# EAGLE design owl (EAGLE 7.5.0)
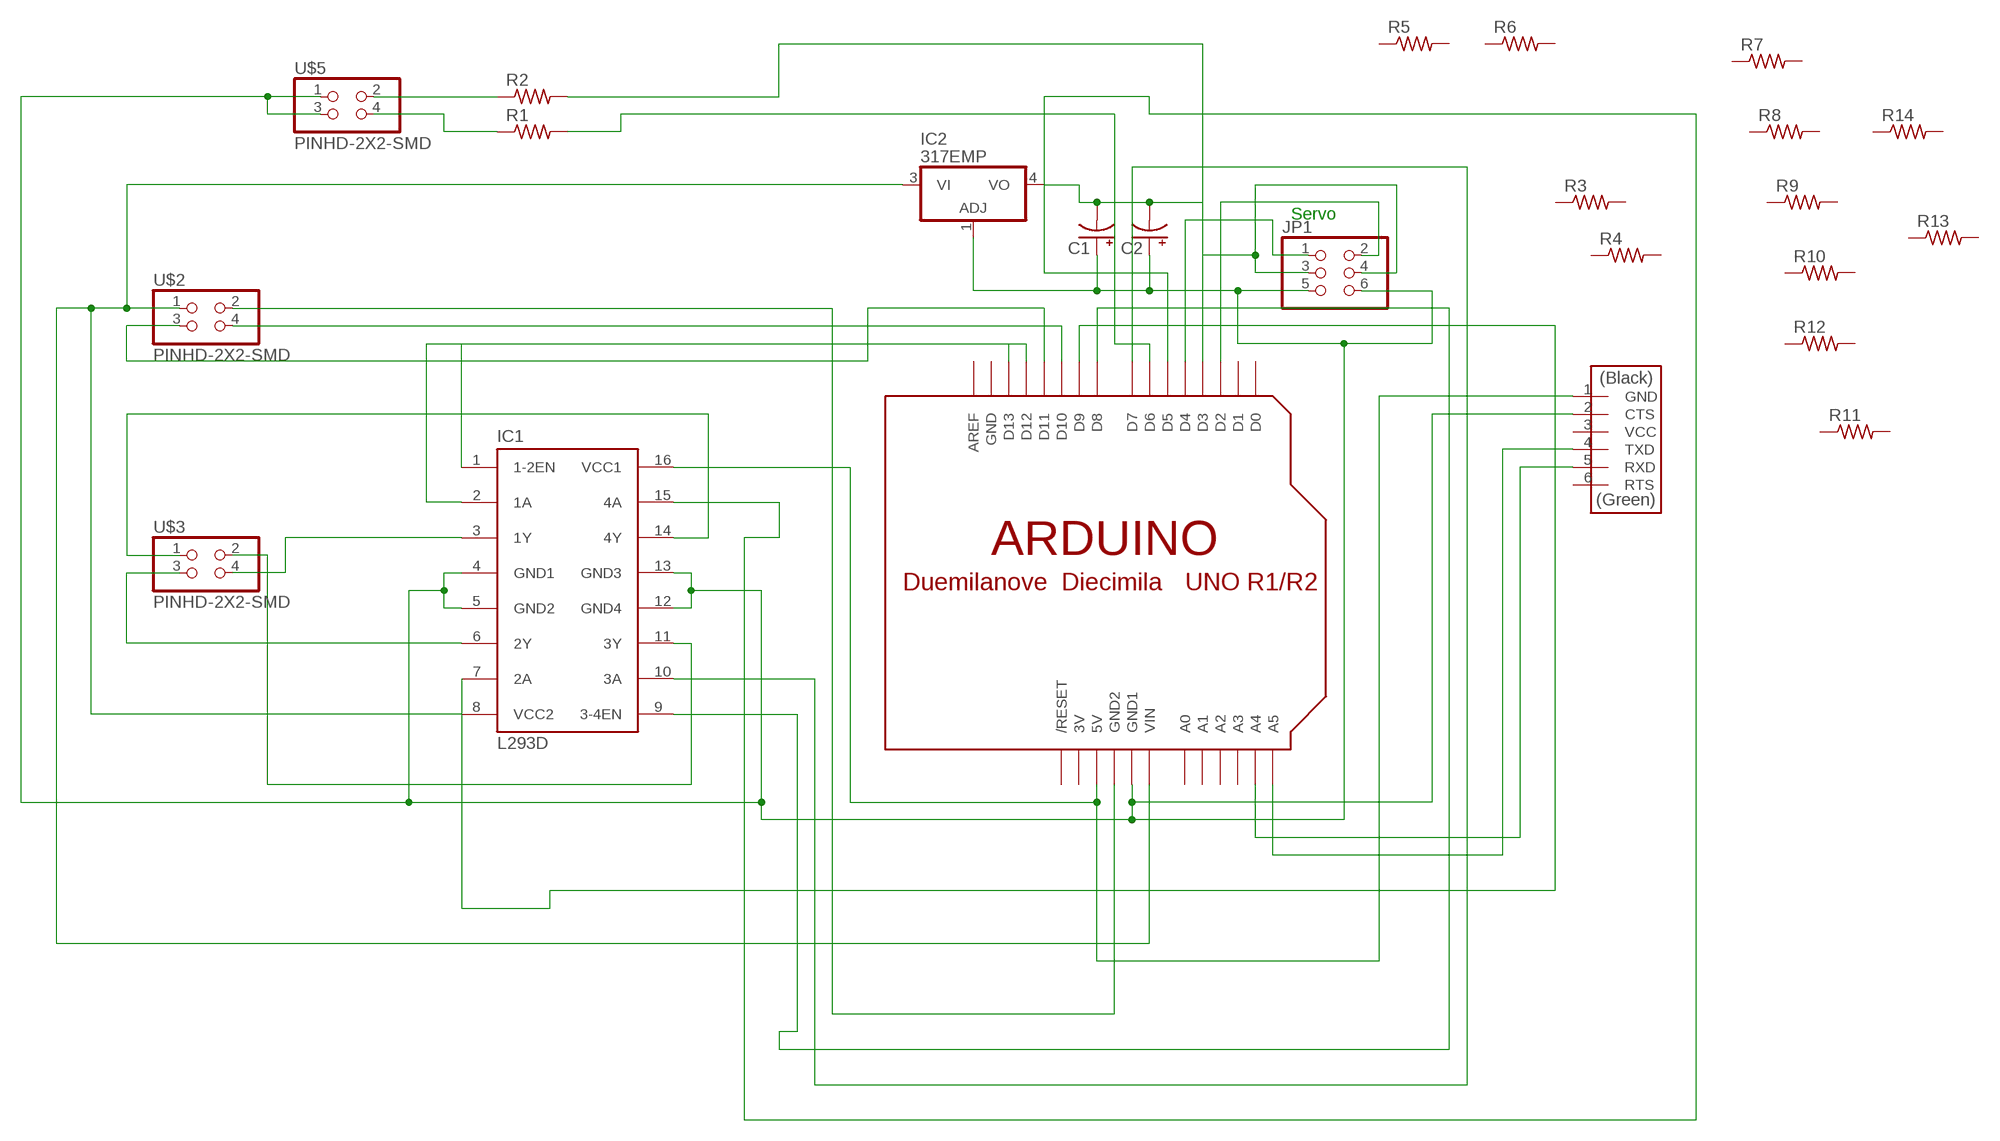
[diagram p0: schematic, sheet 1]

## Parts
C1  CPOL-US085CS-1AR  [085CS_1AR]
C2  CPOL-US085CS-1AR  [085CS_1AR]
IC1  L293D  [DIL16]
IC2  317EMP  [SOT223]
JP1  PINHD-2X3-SMD  [2X03SMD]
R1  RES-US1206FAB  [R1206FAB]
R2  RES-US1206FAB  [R1206FAB]
R3  RES-US1206FAB  [R1206FAB]
R4  RES-US1206FAB  [R1206FAB]
R5  RES-US1206FAB  [R1206FAB]
R6  RES-US1206FAB  [R1206FAB]
R7  RES-US1206FAB  [R1206FAB]
R8  RES-US1206FAB  [R1206FAB]
R9  RES-US1206FAB  [R1206FAB]
R10  RES-US1206FAB  [R1206FAB]
R11  RES-US1206FAB  [R1206FAB]
R12  RES-US1206FAB  [R1206FAB]
R13  RES-US1206FAB  [R1206FAB]
R14  RES-US1206FAB  [R1206FAB]
U$1  ARDUINO-NOHOLE  [ARDUINO-NOHOLE]
U$2  PINHD-2X2-SMD  [2X02SMD]
U$3  PINHD-2X2-SMD  [2X02SMD]
U$4  FTDI-SMD-HEADER  [1X06SMD]
U$5  PINHD-2X2-SMD  [2X02SMD]

## Nets
N$1: IC1.6(2Y) U$3.3
N$2: IC1.3(1Y) U$3.4
N$4: R2.2 U$1.D3
N$6: IC1.1(1-2EN) U$1.D13
N$7: R2.1 U$5.2
N$8: C1.- C2.- IC2.4(VO) JP1.3 JP1.4
N$9: U$1.GND2 U$2.2
N$10: IC1.2(1A) U$1.D12
N$11: U$1.D10 U$2.4
N$12: U$1.D11 U$2.3
N$13: IC1.16(VCC1) U$1.5V U$4.1(GND)
N$14: IC1.7(2A) U$1.D9
N$15: IC1.9(3-4EN) U$1.D8
N$16: IC1.10(3A) U$1.D7
N$17: IC1.15(4A) U$1.D5
N$18: U$1.A5 U$4.4(TXD)
N$19: U$1.A4 U$4.5(RXD)
N$20: JP1.2 U$1.D2
N$21: R1.1 U$5.4
N$23: R1.2 U$1.D6
N$24: JP1.1 U$1.D4
N$26: IC1.14(4Y) U$3.1
N$27: IC1.11(3Y) U$3.2
N$28: C1.+ C2.+ IC1.4(GND1) IC1.5(GND2) IC1.12(GND4) IC1.13(GND3) IC2.1(ADJ) JP1.5 JP1.6 U$1.GND1 U$4.2(CTS) U$5.1 U$5.3
N$30: IC1.8(VCC2) IC2.3(VI) U$1.VIN U$2.1
Unconnected: R3.1 R3.2 R4.1 R4.2 R5.1 R5.2 R6.1 R6.2 R7.1 R7.2 R8.1 R8.2 R9.1 R9.2 R10.1 R10.2 R11.1 R11.2 R12.1 R12.2 R13.1 R13.2 R14.1 R14.2 U$1.A0 U$1.A1 U$1.A2 U$1.A3 U$1.AREF U$1.D0 U$1.D1 U$1.RESET(/RESET) U$4.3(VCC) U$4.6(RTS)

## Notes on the sheet
- Servo

## Power pins joined to a net without a drawn wire
3V: U$1.3V
GND: U$1.GND

## Library data of the parts
C1 C2 = kesäseteli kirjasto:CPOL-US: POLARIZED CAPACITOR, American symbol
IC1 = kesäseteli kirjasto:L293D: PUSH-PULL 4 CHANNEL DRIVER; MPN: L293D; OC_FARNELL: 9589619; OC_NEWARK: 56P8249
IC2 = kesäseteli kirjasto:*317: Positive VOLTAGE REGULATOR
JP1 = kesäseteli kirjasto:PINHD-2X3-SMD: PIN HEADER
R1-R14 = kesäseteli kirjasto:RES-US: Resistor (US Symbol) Variants with postfix FAB are widened to allow the routing of internal traces
U$1 = kesäseteli kirjasto:ARDUINO: Arduino Diecimila/Duemilanove Make a shield with ease, this package has all the named pins as well as the two mounting drill holes and an outline of the USB and DC power connector. The outline is on the DIMENSION layer, so if your board house uses it they will cut the outline to match. http://www.ladyada.net/library/pcb/eaglelibrary.html
U$2 U$3 U$5 = kesäseteli kirjasto:PINHD-2X2-SMD
U$4 = kesäseteli kirjasto:FTDI-SMD-HEADER

## Board
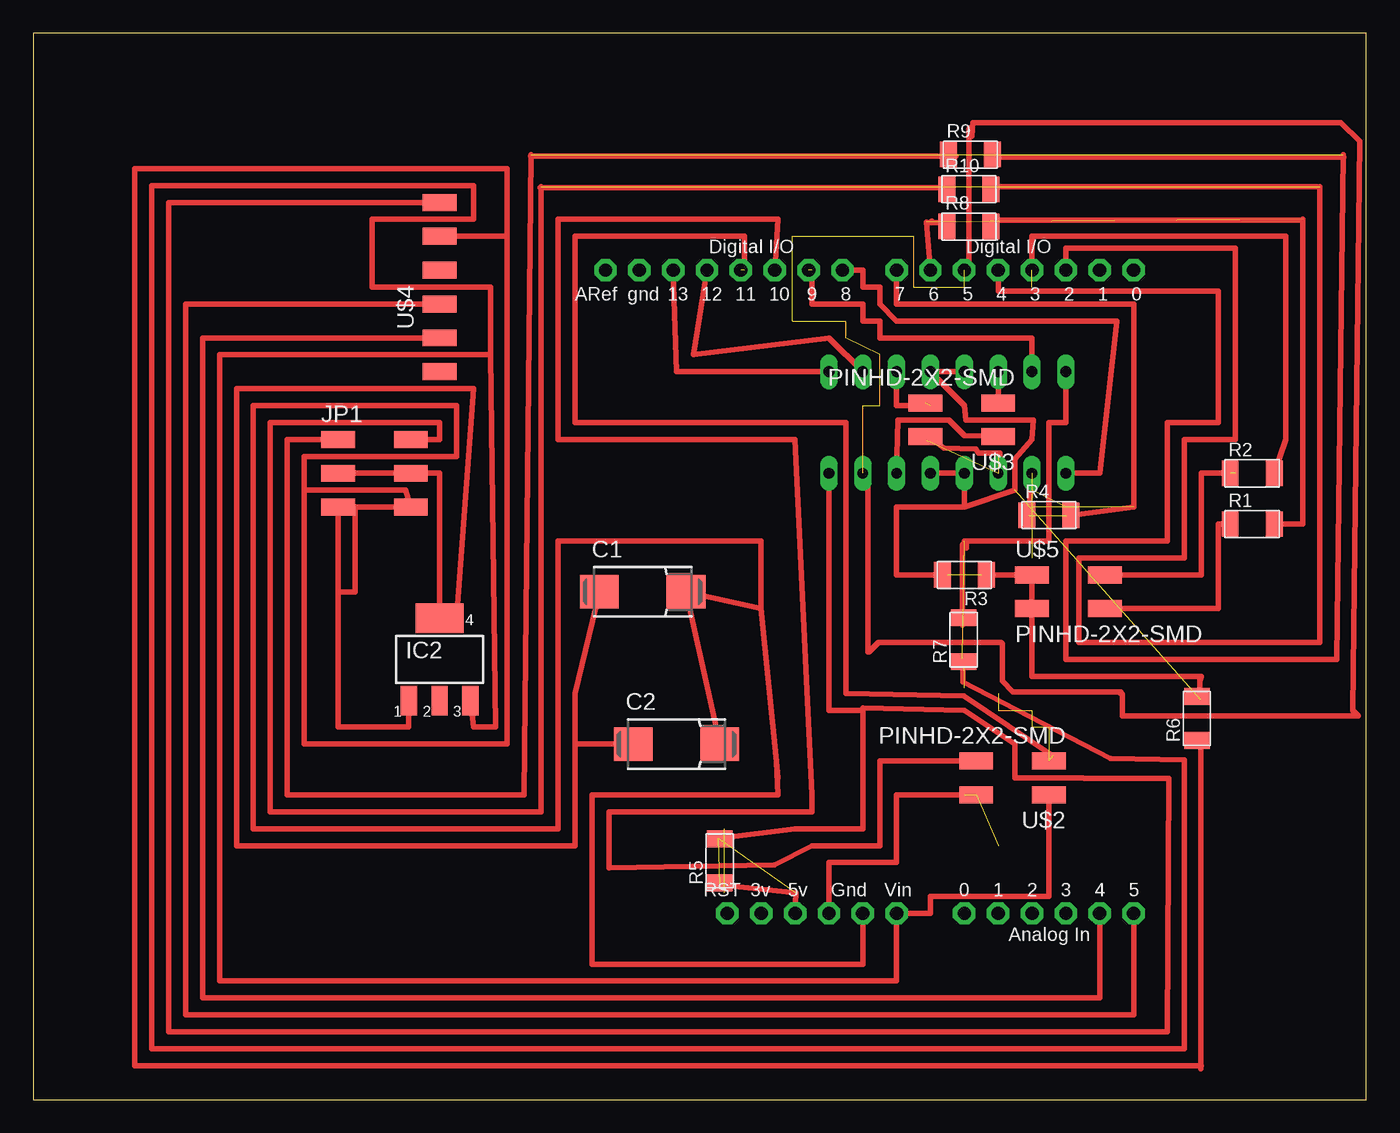
[diagram p1: board, top side]
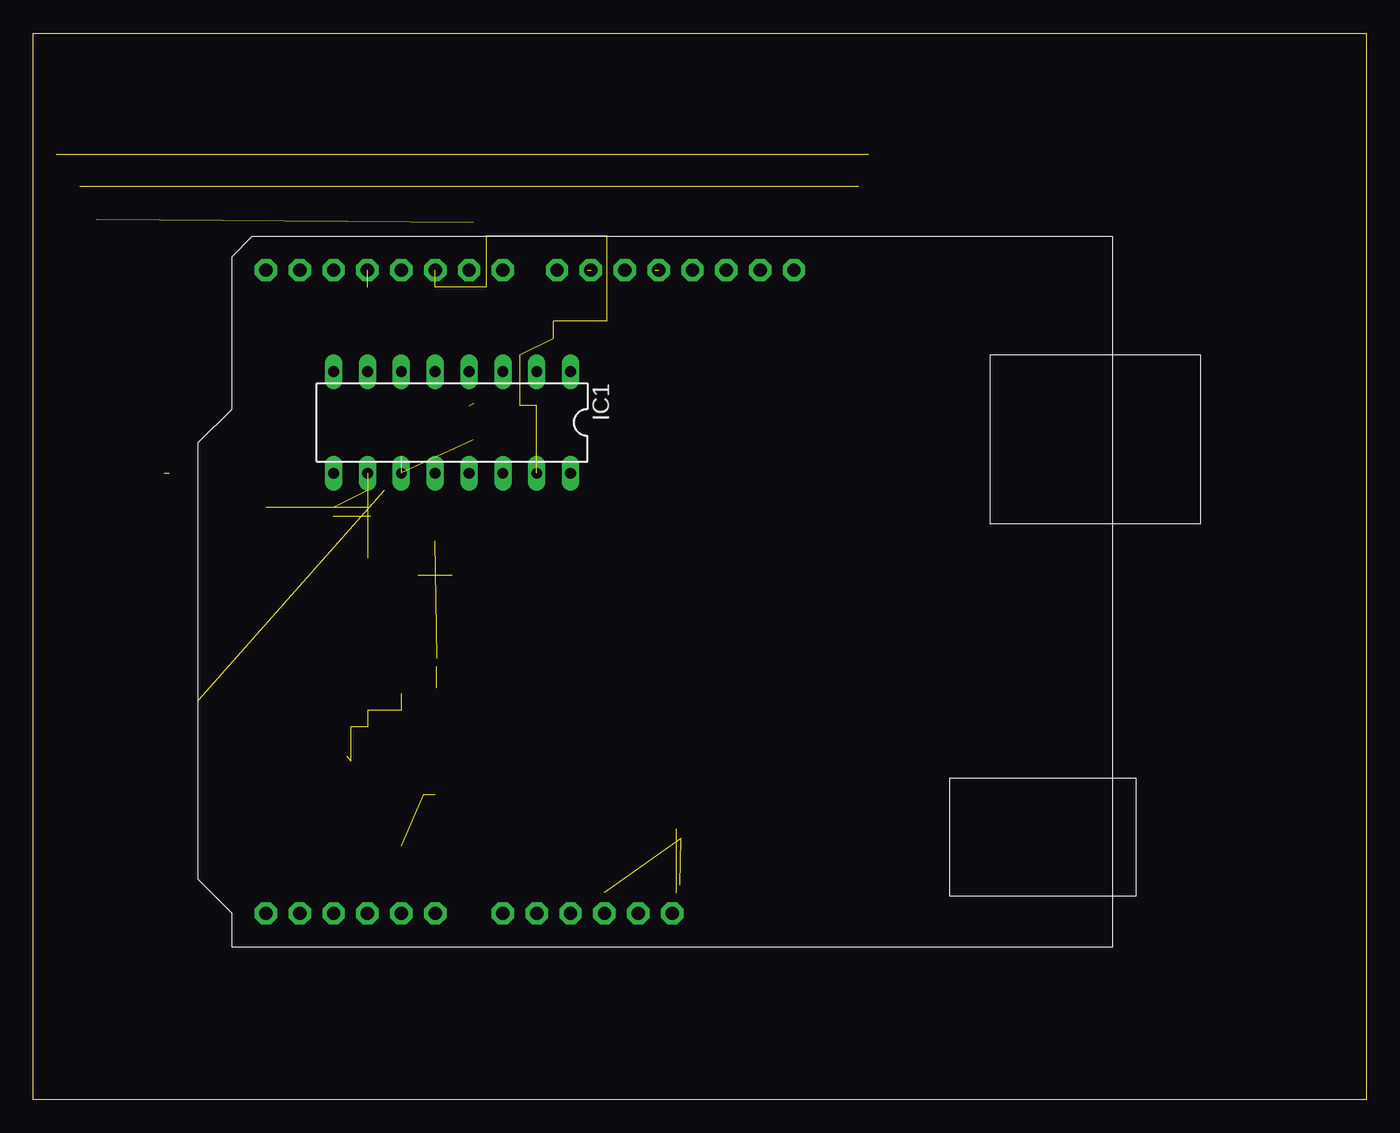
[diagram p2: board, bottom side, seen from below]

Size 100 x 80 mm. Coordinates in mm from the lower left corner, seen from the top.
Outline: 0,0 100,0 100,80 0,80 0,0
Copper layers (1*16): Top 0.035mm / dielectric 1.5mm / Bottom 0.035mm
Design rules "default": minimum track width 10mil, minimum drill 24mil, track to track 8mil, track to pad 8mil, pad to pad 8mil, via to via 8mil, smd to smd 8mil, copper to edge 40mil, drill to drill 8mil, minimum pad ring 10mil, minimum via ring 8mil, stop-mask expansion 4mil, vias tented up to drill 0mil, thermal gap 10mil

### Footprints (pad centres in the part's own frame; a part is rotated, then mirrored left to right if it is on the bottom)
085CS_1AR = smd 2.9 x 2.5: + 3.25,0; - -3.25,0
DIL16 = drill 0.813 long: 1 -8.89,-3.81; 2 -6.35,-3.81; 3 -3.81,-3.81; 4 -1.27,-3.81; 5 1.27,-3.81; 6 3.81,-3.81; 7 6.35,-3.81; 8 8.89,-3.81; 9 8.89,3.81; 10 6.35,3.81; 11 3.81,3.81; 12 1.27,3.81; 13 -1.27,3.81; 14 -3.81,3.81; 15 -6.35,3.81; 16 -8.89,3.81
SOT223 = smd 1.219 x 2.235: 1 -2.311,-3.099; 2 0,-3.099; 3 2.311,-3.099 | smd 3.6 x 2.2: 4 0,3.099
2X03SMD = smd 2.54 x 1.27: 1 -2.54,2.54; 2 2.92,2.54; 3 -2.54,0; 4 2.92,0; 5 -2.54,-2.54; 6 2.92,-2.54
R1206FAB = smd 1.27 x 1.905: 1 -1.651,0; 2 1.651,0
ARDUINO-NOHOLE = drill 1 pad 1.676 octagon: 3V 35.56,2.54; 5V 38.1,2.54; A0 50.8,2.54; A1 53.34,2.54; A2 55.88,2.54; A3 58.42,2.54; A4 60.96,2.54; A5 63.5,2.54; AREF 23.876,50.8; D0 63.5,50.8; D1 60.96,50.8; D2 58.42,50.8; D3 55.88,50.8; D4 53.34,50.8; D5 50.8,50.8; D6 48.26,50.8; D7 45.72,50.8; D8 41.656,50.8; D9 39.116,50.8; D10 36.576,50.8; D11 34.036,50.8; D12 31.496,50.8; D13 28.956,50.8; GND 26.416,50.8; GND1 43.18,2.54; GND2 40.64,2.54; RESET 33.02,2.54; VIN 45.72,2.54
2X02SMD = smd 2.54 x 1.27: 1 -2.54,1.27; 2 2.92,1.27; 3 -2.54,-1.27; 4 2.92,-1.27
1X06SMD = smd 2.54 x 1.27: 1 0,6.35; 2 0,3.81; 3 0,1.27; 4 0,-1.27; 5 0,-3.81; 6 0,-6.35

### Placement (x,y rotation side)
C1  45.72,38.1 0 top
C2  48.26,26.67 0 top
IC1  68.58,50.8 180 bottom
IC2  30.48,33.02 0 top
JP1  25.4,46.99 0 top
R1  91.44,43.18 0 top
R2  91.44,46.99 0 top
R3  69.85,39.37 180 top
R4  76.2,43.85 0 top
R5  51.5,17.9 90 top
R6  87.3,28.6 90 top
R7  69.8,34.5 90 top
R8  70.2,65.5 0 top
R9  70.3,70.9 0 top
R10  70.2,68.3 0 top
R11  2.4,-17.9 0 top  (outside the outline)
R12  2.4,-21.7 0 top  (outside the outline)
R13  2.4,-25.5 0 top  (outside the outline)
R14  2.4,-29.3 0 top  (outside the outline)
U$1  19.05,11.43 0 top
U$2  73.66,24.13 180 top
U$3  69.85,51 180 top
U$4  30.48,60.96 0 top
U$5  77.47,38.1 0 top

### Tracks (layer width: path | path; a pad name or v marks a point on that pad's centre or on a via)
N$1
  Top 0.406: IC1.6 U$3.3
N$2  (1 unrouted)
  Top 0.406: IC1.3 64.77,52.07 67.31,52.07
N$4  (1 unrouted)
  Top 0.406: R2.2 93.98,49.53 93.98,64.77 74.93,64.77 U$1.D3
N$6
  Top 0.406: U$1.D13 48.26,54.61 IC1.1
N$7  (1 unrouted)
  Top 0.406: U$5.2 87.63,39.37 87.63,46.99 90.17,46.99
N$8
  Top 0.406: JP1.3 JP1.4 30.48,46.99 IC2.4 | IC2.4 30.48,35.56 | IC2.4 31.75,36.12 33.02,53.34 15.24,53.34 15.24,19.05 40.64,19.05 40.64,26.67 | C1.- 40.64,30.48 40.64,26.67 | C2.- 40.64,26.67
N$9  (2 unrouted)
  Top 0.406: U$1.GND2 59.69,17.78 64.77,17.78 64.77,22.86 69.85,22.86
N$10
  Top 0.406: U$1.D12 49.53,55.88 59.69,57.15 IC1.2
N$11
  Top 0.406: U$1.D10 55.88,66.04 39.37,66.04 39.37,49.53 57.15,49.53 58.42,22.86 58.42,21.59 43.18,21.59 43.2,17.4 55.6,17.6 58.42,19.05 63.5,19.05 63.5,25.4 U$2.4
N$12  (7 unrouted)
  Top 0.406: 53.34,62.23 53.34,64.77 40.64,64.77 40.64,50.8 60.96,50.8 60.96,30.48 69.8,30.3 76.5,25.8
N$13  (3 unrouted)
  Top 0.406: U$4.1 10.16,67.31 10.16,5.08 85.09,5.08 85.19,24.11 78.84,24.11 78.74,24.13 73.66,24.13 73.66,26.67 69.85,29.21 62.23,29.39 62.23,29.21 | 62.23,29.21 62.23,20.32 57.15,20.32 51.4,19.6 | IC1.16 59.69,29.21 62.23,29.21 | U$1.5V 57.2,15.5 51.5,16.1
N$14  (1 unrouted)
  Top 0.406: IC1.7 74.93,57.15 63.5,57.15 63.5,58.42 62.23,58.42 62.23,59.69 58.42,59.69 58.42,62.23
N$15
  Top 0.406: IC1.9 80.01,46.99 81.28,58.42 64.77,58.42 63.5,59.69 63.5,60.96 62.23,60.96 62.23,62.23 U$1.D8
N$16  (7 unrouted)
  Top 0.406: U$1.D7 64.77,59.69 82.55,59.69 82.55,44.45 77.5,43.8 | IC1.10 74.7,43.8
N$17  (11 unrouted)
N$18
  Top 0.406: U$1.A5 82.55,6.35 11.43,6.35 11.43,59.69 U$4.4
N$19
  Top 0.406: U$1.A4 80.01,7.62 12.7,7.62 12.7,57.15 U$4.5
N$20  (1 unrouted)
  Top 0.406: JP1.2 30.48,49.53 30.48,50.8 17.78,50.8 17.78,21.59 38.1,21.59 38.1,68.51 | 96.52,68.51 96.52,34.29 78.44,34.29 78.44,40.64 86.36,40.64 86.36,49.53 90.17,49.53 90.17,63.9 77.47,63.9 U$1.D2
N$21
  Top 0.406: U$5.4 88.9,36.83 88.9,43.18 R1.1
N$22
  Top 0.406: 67.6,49.4 68.3,48.9 70.7,48.8 70.9,48.5 72.5,48.5 72.4,46.9
N$23  (1 unrouted)
  Top 0.406: R1.2 95.25,43.18 95.25,66.04 | 67.01,65.84 U$1.D6
N$24  (1 unrouted)
  Top 0.406: JP1.1 19.05,49.53 19.05,22.86 36.83,22.86 37.33,70.88 | 98.29,70.88 97.79,33.02 77.47,33.02 77.47,41.91 85.09,41.91 85.09,50.8 88.9,50.8 88.9,60.66 72.39,60.66 U$1.D4
N$26
  Top 0.406: IC1.14 64.87,51 68.68,51 69.85,49.83 U$3.1
N$27  (2 unrouted)
  Top 0.406: U$3.2 67,49.5
N$28  (2 unrouted)
  Top 0.406: JP1.5 22.86,38.1 | 22.86,38.1 22.86,27.94 28.17,27.94 IC2.1 | 20.32,45.72 27.94,45.72 JP1.6 24.13,44.45 24.13,38.1 22.86,38.1 | 20.32,45.72 20.32,26.67 35.56,26.67 35.56,64.77 | 35.56,64.77 U$4.2 | 54.61,36.83 C1.+ C2.+ | U$1.GND1 62.23,10.16 41.91,10.16 41.91,22.86 55.88,22.86 55.75,25.39 | 35.56,64.77 35.56,69.85 7.62,69.85 7.62,2.54 87.63,2.54 | 55.88,24.13 55.75,25.39 | 55.75,25.39 54.61,36.83 | IC1.13 IC1.12 69.85,44.45 | IC1.5 IC1.4 69.85,52.07 69.95,51 75.03,51 74.93,49.53 73.66,48.06 73.66,45.72 69.85,44.45 | 54.61,36.83 54.61,41.91 39.37,41.91 39.37,20.32 16.51,20.32 16.51,52.07 31.75,52.07 31.75,48.26 20.32,48.26 20.32,45.72 | 69.85,44.45 64.77,44.45 64.77,39.37 68.58,39.37 | 71.12,39.37 U$5.1 U$5.3 74.93,31.75 87.63,31.75 87.5,31.4 87.5,30 | 87.5,30 87.4,30.4 87.4,30 87.5,30 | 87.5,30 87.6,30
N$29
  Top 0.406: 87.6,27 87.6,2.3
N$30  (1 unrouted)
  Top 0.406: IC2.3 33.02,27.94 34.69,27.94 34.29,55.88 | 34.29,55.88 13.97,55.88 13.97,8.89 64.77,8.89 U$1.VIN 67.31,13.97 67.31,15.24 76.2,15.24 U$2.1 | 34.29,55.88 34.29,60.96 25.4,60.96 25.4,66.04 33.02,66.04 33.02,68.58 8.89,68.58 8.89,3.81 86.36,3.81 86.36,25.48 80.8,25.6 69.75,31.32 69.7,33.1 | 69.85,41.91 76.2,41.91 76.2,50.8 77.47,50.8 IC1.8
N$31
  Top 0.406: 62.3,47.1 62.6,46.8 62.6,33.6
N$32
  Top 0.406: 70,41.4 70,41.9 69.7,41.6 69.7,36.3 | 69.7,36.3 69.7,35.6 69.8,35.7 69.8,36.3 69.7,36.3
N$33  (1 unrouted)
  Top 0.406: 69.4,32.9 69.8,32.5
N$34
  Top 0.406: 62.7,33.6 63.4,34.3 72.6,34.3 72.7,34.2 72.7,31.4 73.5,30.6 81.4,30.6 | 81.5,30.6 81.6,30.6 | 81.5,30.5 81.4,30.6 | 81.4,30.6 81.5,30.6 | 81.5,30.6 81.7,30.4 81.7,28.8 99.4,28.8 99,29.2 99.5,71.9 98.1,73.3 70.5,73.3 70.4,72.3
N$35
  Top 0.406: 37.3,70.8 69.2,70.8
N$36
  Top 0.406: 71.7,70.7 98.3,70.7
N$37
  Top 0.406: 96.3,68.5 71.7,68.5
N$38
  Top 0.406: 68.4,68.4 38,68.4
N$40
  Top 0.406: 72.1,65.8 72.3,66 95.1,66
N$41
  Top 0.406: 70.3,72.9 70.2,72.8 70.2,62.2
N$42
  Top 0.406: 67.4,65.9 67.3,65.8 | 67.3,65.8 67,65.8 | 68.6,65.8 67.7,65.8 67.4,65.8 67.3,65.8